# Altium schematic sheet PowerScheme.SchDoc
size A; SheetNumber: 2; SheetTotal: 2
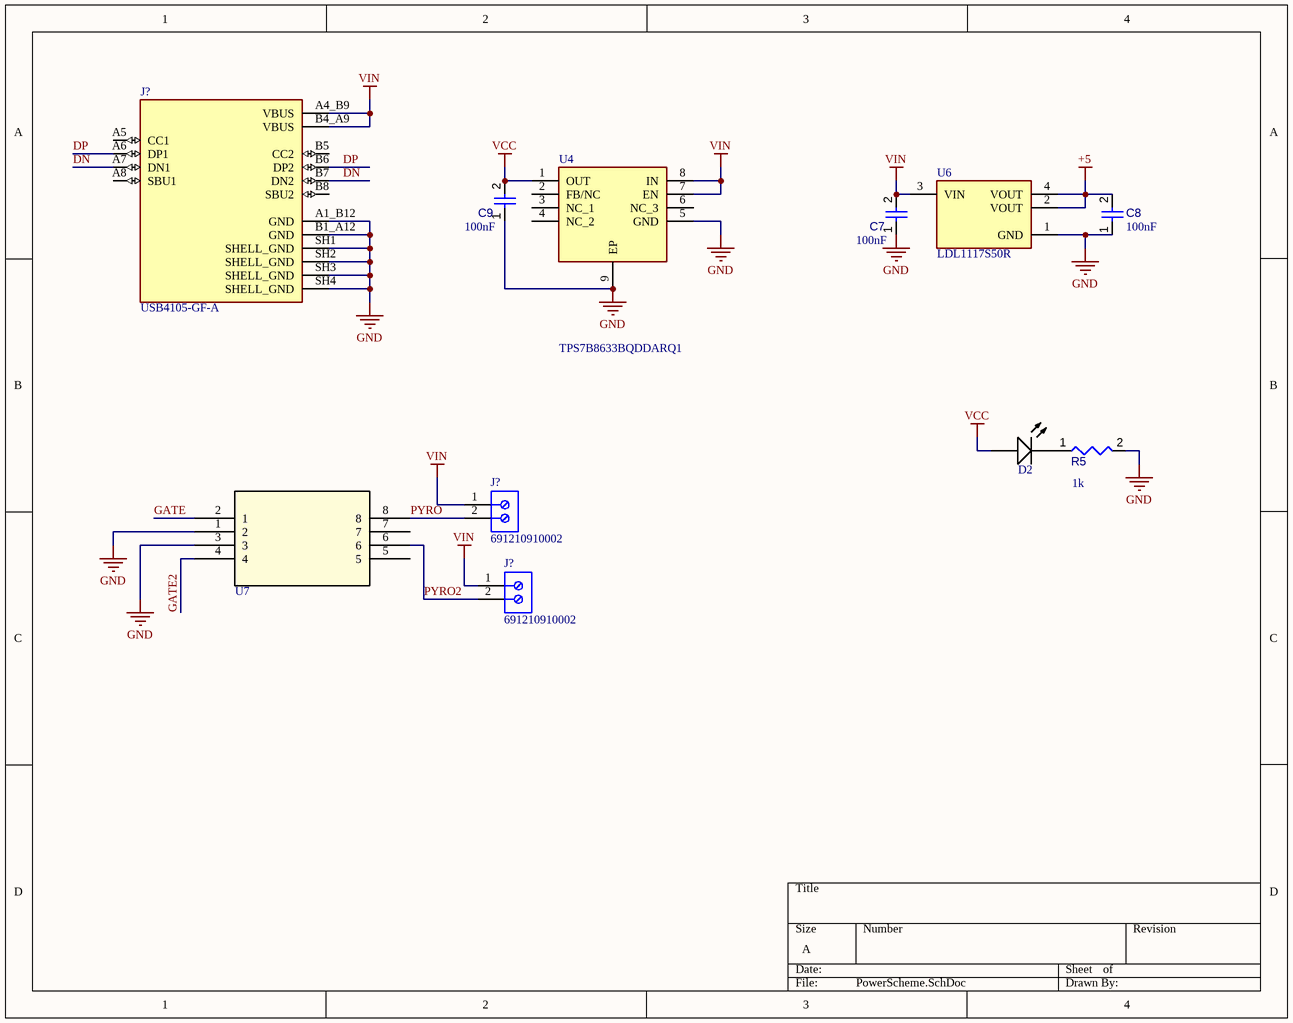
[diagram p0: PowerScheme.SchDoc]

## Parts
(Parts that share a designator on the sheet are numbered #1, #2 ... from top to bottom, then left to right.)
C7  value 100nF  [CAPC1608X90X40NL10T20]  (hidden comment: Capacitor 100 nF +/-10% 50 V 0603)
C8  value 100nF  [CAPC1608X90X40NL10T20]  (hidden comment: Capacitor 100 nF +/-10% 50 V 0603)
C9  value 100nF  [CAPC1608X90X40NL10T20]  (hidden comment: Capacitor 100 nF +/-10% 50 V 0603)
D2  HSMW-C191  [AVAG-HSMW-C191_V]  (value not drawn)
J?#1  USB4105-GF-A  [GCT_USB4105-GF-A]
J?#2  691210910002  [691210910002]
J?#3  691210910002  [691210910002]
R5  value 1k  [RESC1608X55X25ML10T15]  (hidden comment: Resistor 1k +/-1% 0603 100 mW)
U4  TPS7B8633BQDDARQ1  [SOIC127P600X170-9N]
U6  LDL1117S50R  [FP-SOT-223-0046067_14-MFG]
U7  SP8K2TB  [TRANS_RSH065N_ROM]  (value not drawn)

## Nets
+5: C8.2 U6.2(VOUT) U6.4(VOUT)
GND: C7.1 C8.1 C9.1 J?#1.A1_B12(GND) J?#1.B1_A12(GND) J?#1.SH1(SHELL_GND) J?#1.SH2(SHELL_GND) J?#1.SH3(SHELL_GND) J?#1.SH4(SHELL_GND) R5.2 U4.5(GND) U4.9(EP) U6.1(GND) U7.1(2) U7.3
VCC: C9.2 D2.1(A) U4.1(OUT)
VIN: C7.2 J?#1.A4_B9(VBUS) J?#1.B4_A9(VBUS) J?#2.1 J?#3.1 U4.7(EN) U4.8(IN) U6.3(VIN)
DN: J?#1.A7(DN1) J?#1.B7(DN2)
DP: J?#1.A6(DP1) J?#1.B6(DP2)
GATE: U7.2(1)
GATE2: U7.4
PYRO: J?#2.2 U7.8
PYRO2: J?#3.2 U7.6
NetD2_2: D2.2(K) R5.1

Not connected (* = marked no-connect by the designer): J?#1 A5(CC1) A8(SBU1) B5(CC2) B8(SBU2); U4 2(FB/NC) 3(NC_1) 4(NC_2) 6(NC_3); U7 5 7

## Library data of the parts
C7-C9 = CMP-001-00017-6: Chip Capacitor, 100 nF, +/- 10%, 50 V, 0603 (1608 Metric); Capacitor Type: Ceramic; Voltage Rating: 50V; Mounting Technology: SM; Case/Package: 0603; Pins: 2; RoHS Compliant: True; Min Operating Temperature: -55°C; Max Operating Temperature: 125°C; Tolerance: 10%
D2 = CMP-007-00016-2: LED Uni-Color White, 78 mW, 20 mA, -40 to 85 degC, 2-Pin SMD, RoHS, Tape and Reel; Manufacturer: Avago; Forward Voltage: 3.6V; Forward Current: 20mA; Power: 78mW; Lens Style: Diffused; Luminous Intensity: 200mcd; Viewing Angle: 140degrees; Mounting Technology: SM; Case/Package: 0603; Pins: 2; RoHS Compliant: True; Min Operating Temperature: -40°C; Max Operating Temperature: 85°C; Colour: White; Nominal Vf: 3.6V; Illumination Colour: White; Package Quantity: 4000; Package Reference: HSMW-C191; Datasheet Version: May-10; Package Description: 2-Pin Surface Mount Device, Body 1.6 x 0.8 mm; Packaging: TapeandReel; Manufacturer URL: http://www.avagotech.com/; Datasheet URL: http://docs.avagotech.com/docs/AV02-0186EN
J?#1 = CMP-002-00071-1: USB-C (USB TYPE-C) USB 2.0 Receptacle Connector 24 (16+8 Dummy) Position Surface Mount, Right Angle; Through Hole; MF: GCT; Pins: 16; Check_prices: https://www.snapeda.com/parts/USB4105-GF-A/Global+Connector+Technology/view-part/?ref=eda; SnapEDA_Link: https://www.snapeda.com/parts/USB4105-GF-A/Global+Connector+Technology/view-part/?ref=snap; Component Type: Standard; MP: USB4105-GF-A; Design Item ID: USB4105-GF-A; Value: *; Source: USB4105-GF-A.SchLib; Case/Package: None
J?#2 J?#3 = CMP-002-00073-1: Barrier Strip Terminal Block; RoHS Compliant: Yes
R5 = CMP-009-00014-5: Chip Resistor, 1 KOhm, +/-1%, 0.1 W, -55 to 155 degC, 0603 (1608 Metric); Tolerance: 1%; Power: 100mW; Voltage Rating: 50V; Mounting Technology: SM; Case/Package: 0603; Pins: 2; RoHS Compliant: True; Min Operating Temperature: -55°C; Max Operating Temperature: 155°C
U4 = CMP-013-000000-1: LDO Voltage Regulators Automotive 500-mA, 40-V, ultra-low-IQ, low-dropout (LDO) linear regulator with power good 8-SO PowerPAD -40 to 150; Manufacturer_Name: Texas Instruments; Geometry.Height: 1.7mm; Datasheet Link: https://www.ti.com/general/docs/suppproductinfo.tsp?distId=26&gotoUrl=https://www.ti.com/lit/gpn/tps7b86-q1; Manufacturer_Part_Number: TPS7B8633BQDDARQ1; Mouser Price/Stock: https://www.mouser.co.uk/ProductDetail/Texas-Instruments/TPS7B8633BQDDARQ1?qs=ulEaXIWI0c8jShQv7JB9Ew%3D%3D; Source: TPS7B8633BQDDARQ1.SchLib; Mouser Part Number: 595-PS7B8633BQDDARQ1; Arrow Part Number: *; Design Item ID: TPS7B8633BQDDARQ1; Arrow Price/Stock: *
U6 = CMP-019-00049-1: Fixed Positive LDO Regulator, 5V, 0.6V Dropout, PDSO4; Max Supply Voltage: 18V; Case/Package: SOP; RoHS Compliant: Yes; Pins: 4
U7 = CMP-009-00177-1: No Description Available; Mfr_Name: ROHM Semiconductor; Component Type: Standard; RefDes: RefDes; Digi-Key_Part_Number_2: SP8K2TBDKR-ND; Digi-Key_Part_Number_1: SP8K2TBCT-ND; Pins: 8; Design Item ID: SP8K2TB; Digi-Key_Part_Number_3: SP8K2TBTR-ND; Source: SP8K2TB.SchLib; Type: Type